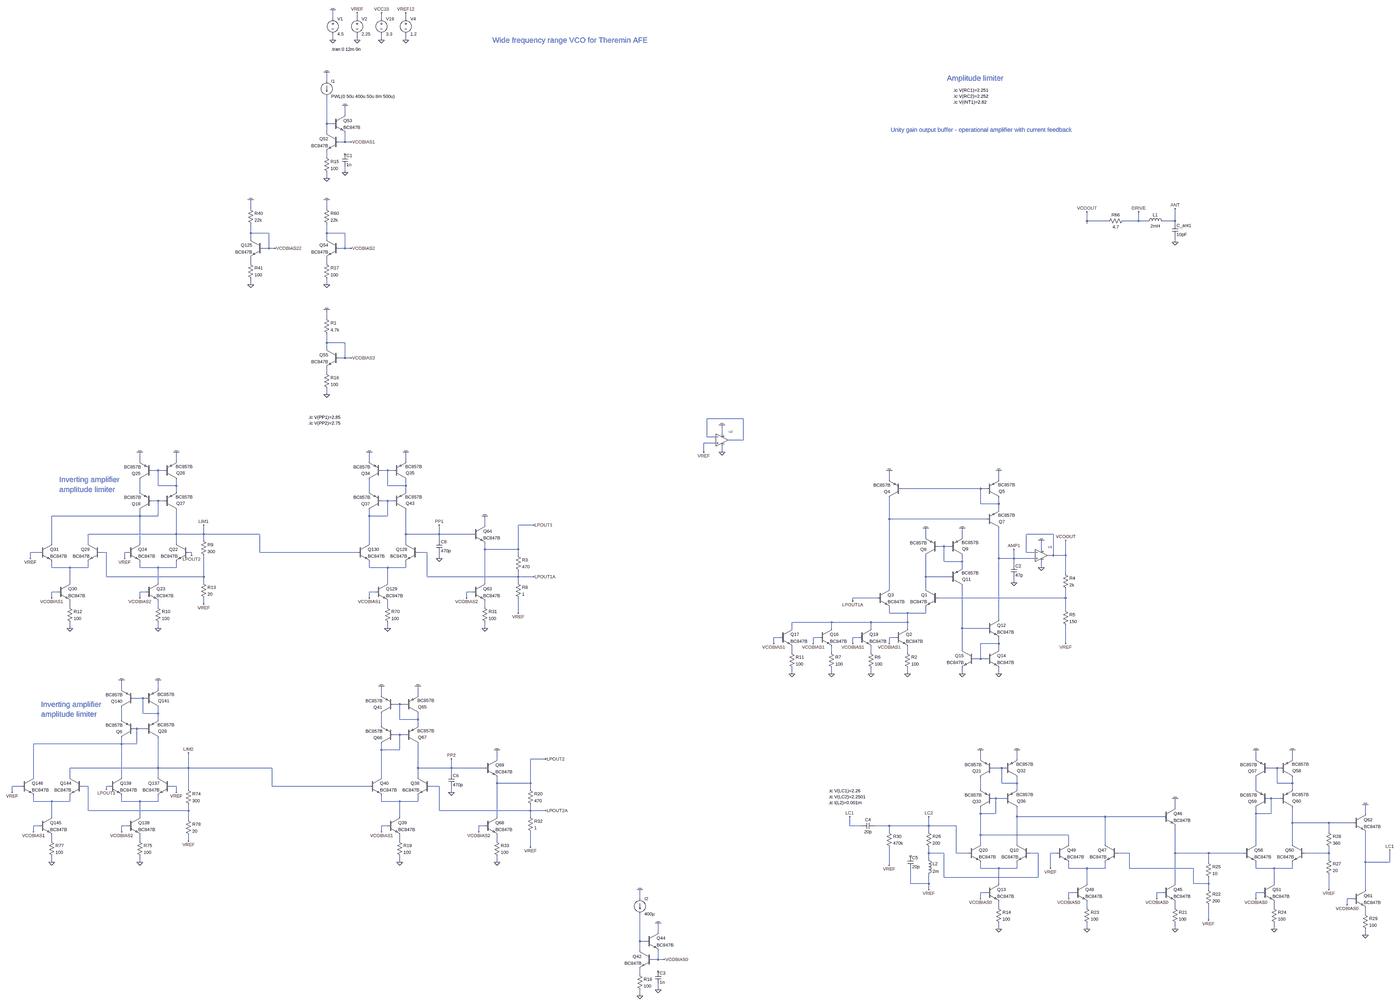
[diagram p0: schematic vco_sine_bjt_v08.asc, whole sheet]
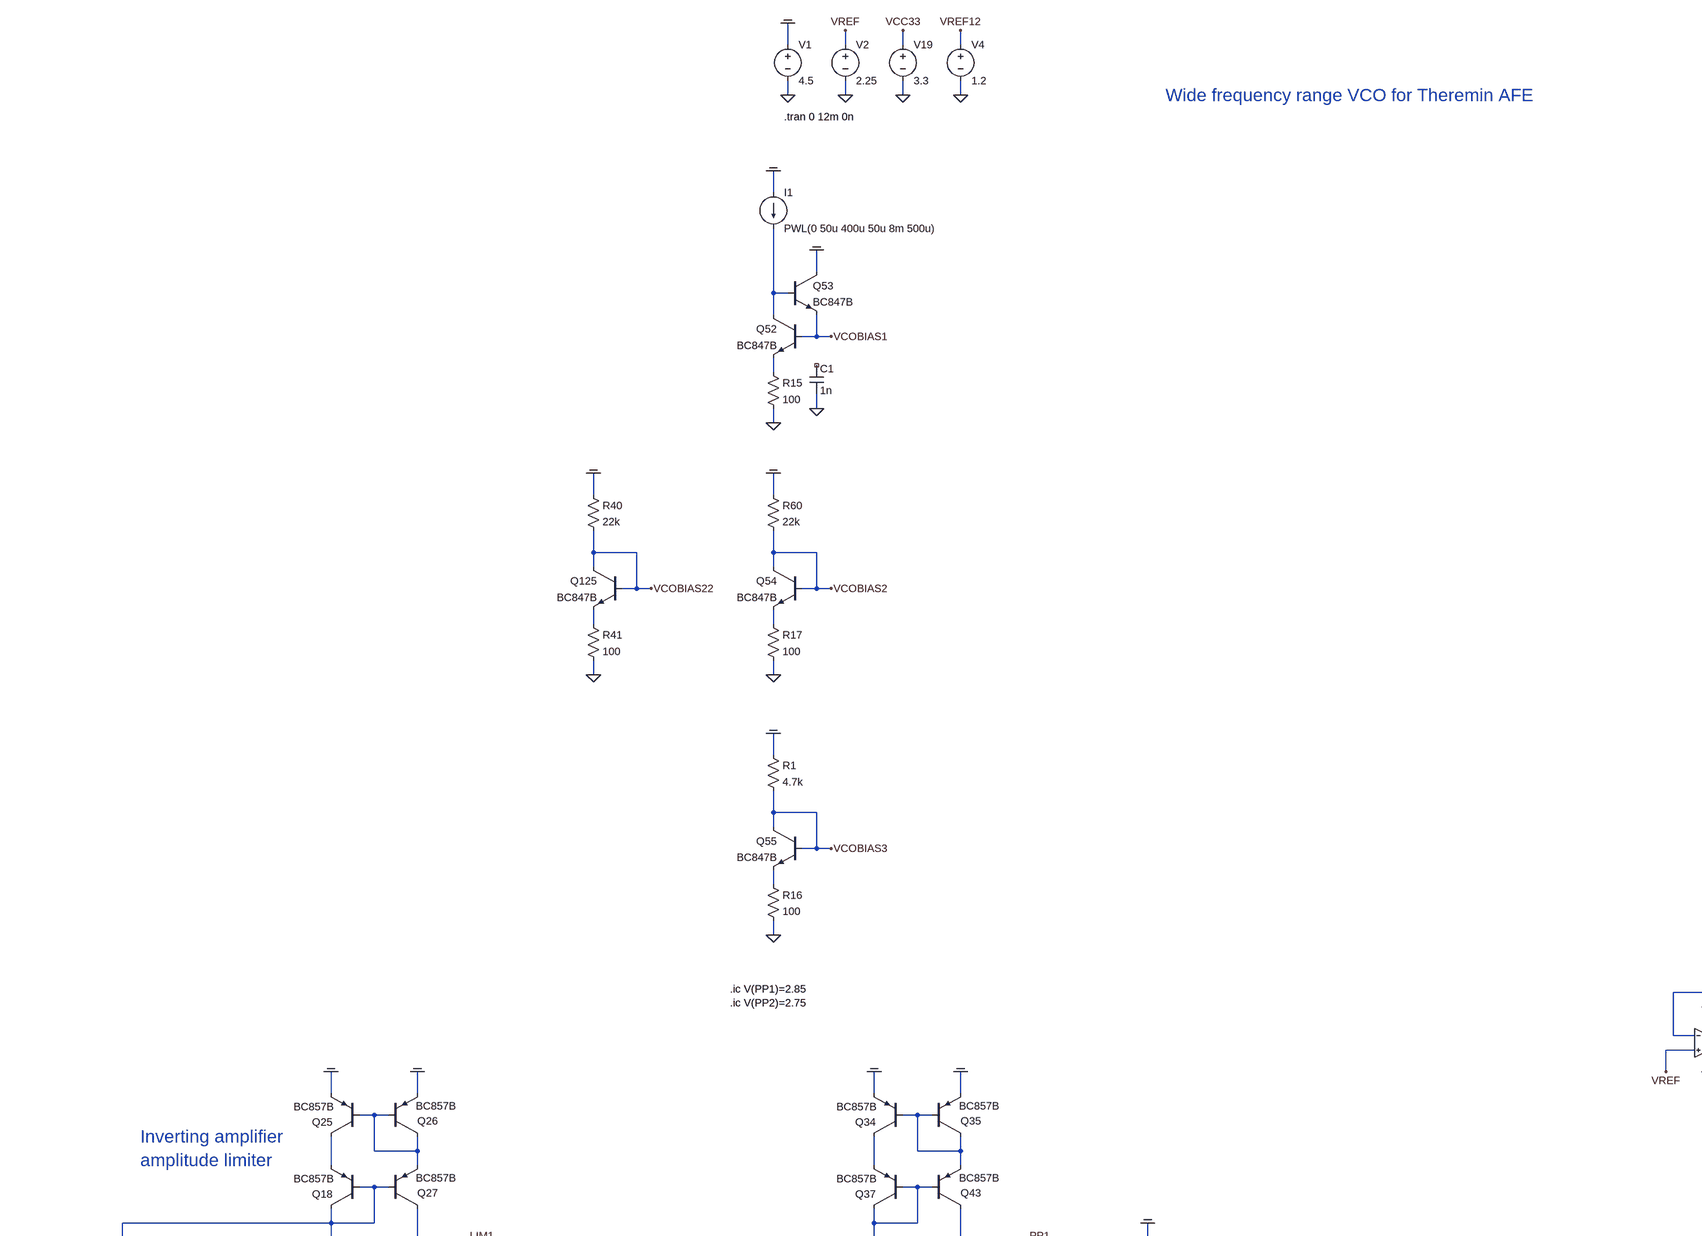
[diagram p1: schematic vco_sine_bjt_v08.asc, part, row 1 of 2, column 1 of 2]
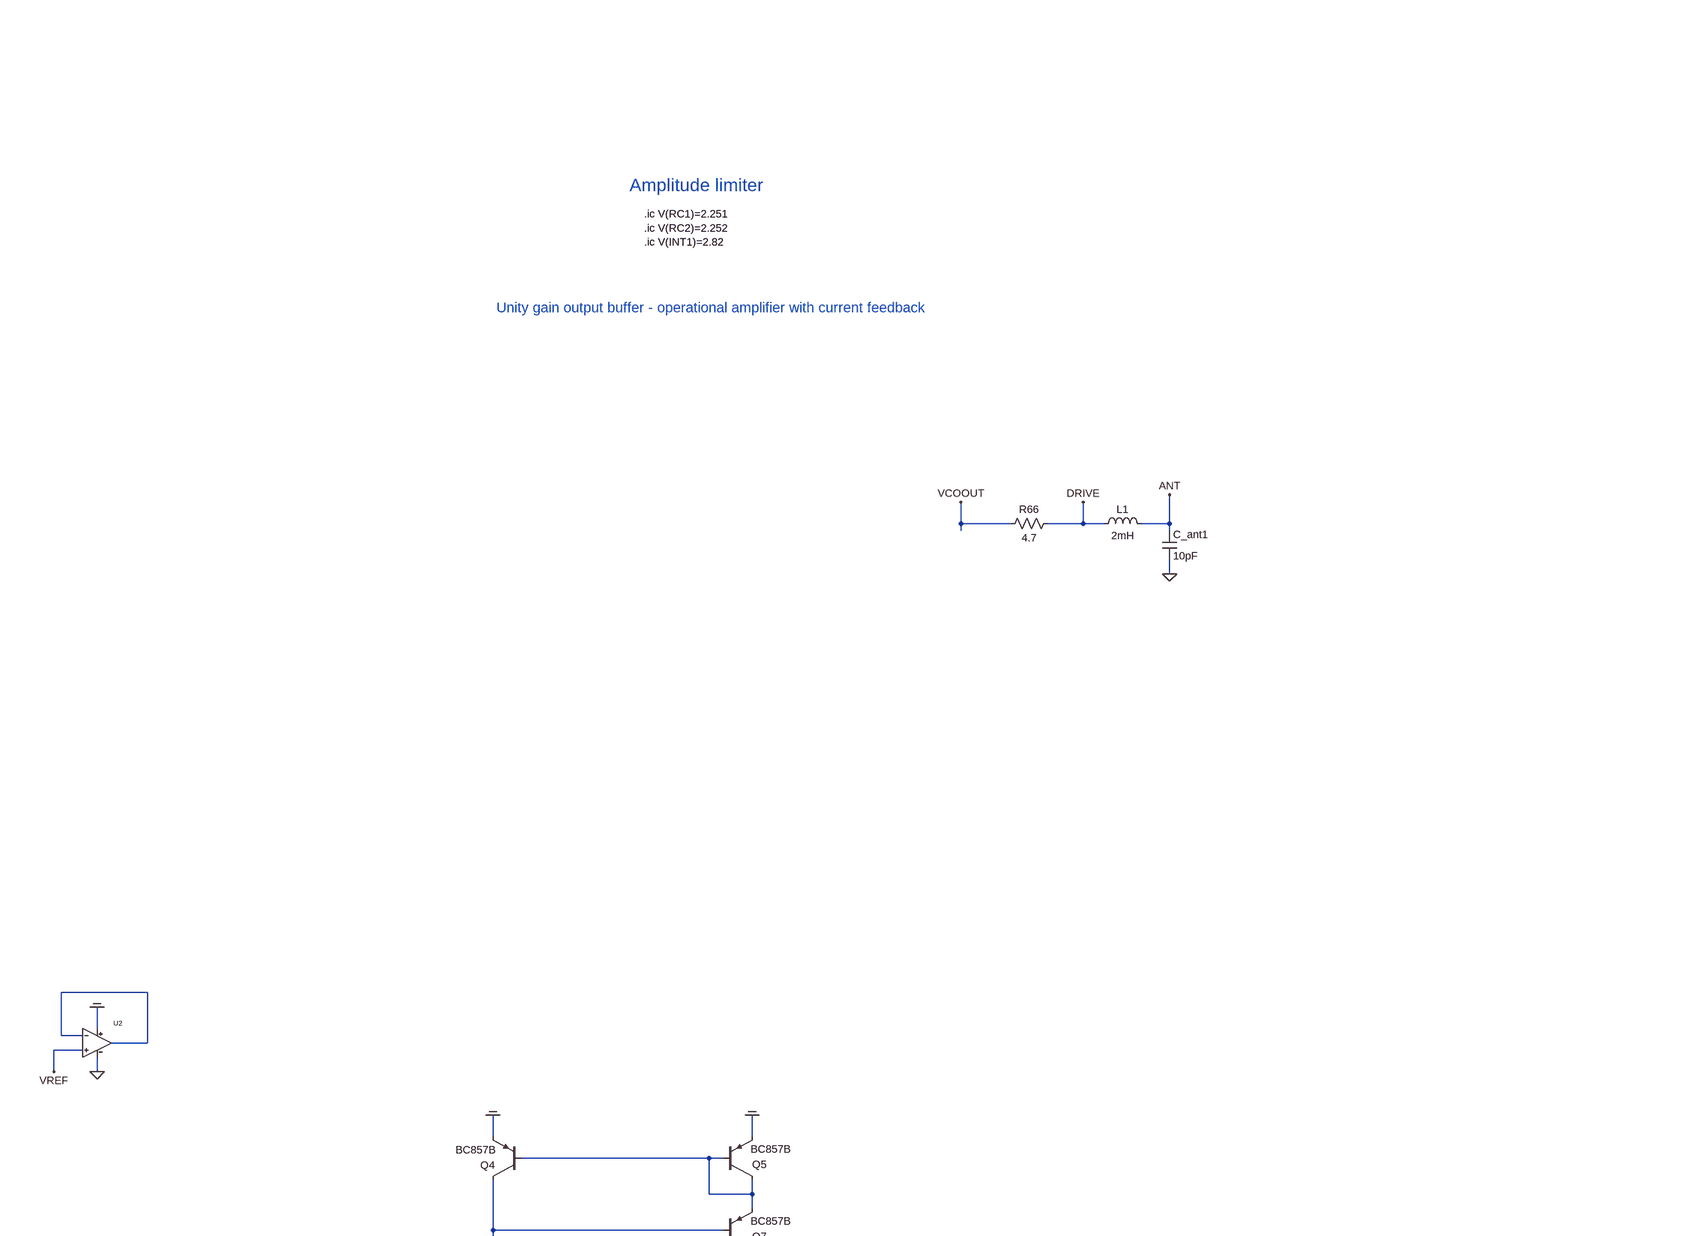
[diagram p2: schematic vco_sine_bjt_v08.asc, part, row 1 of 2, column 2 of 2]
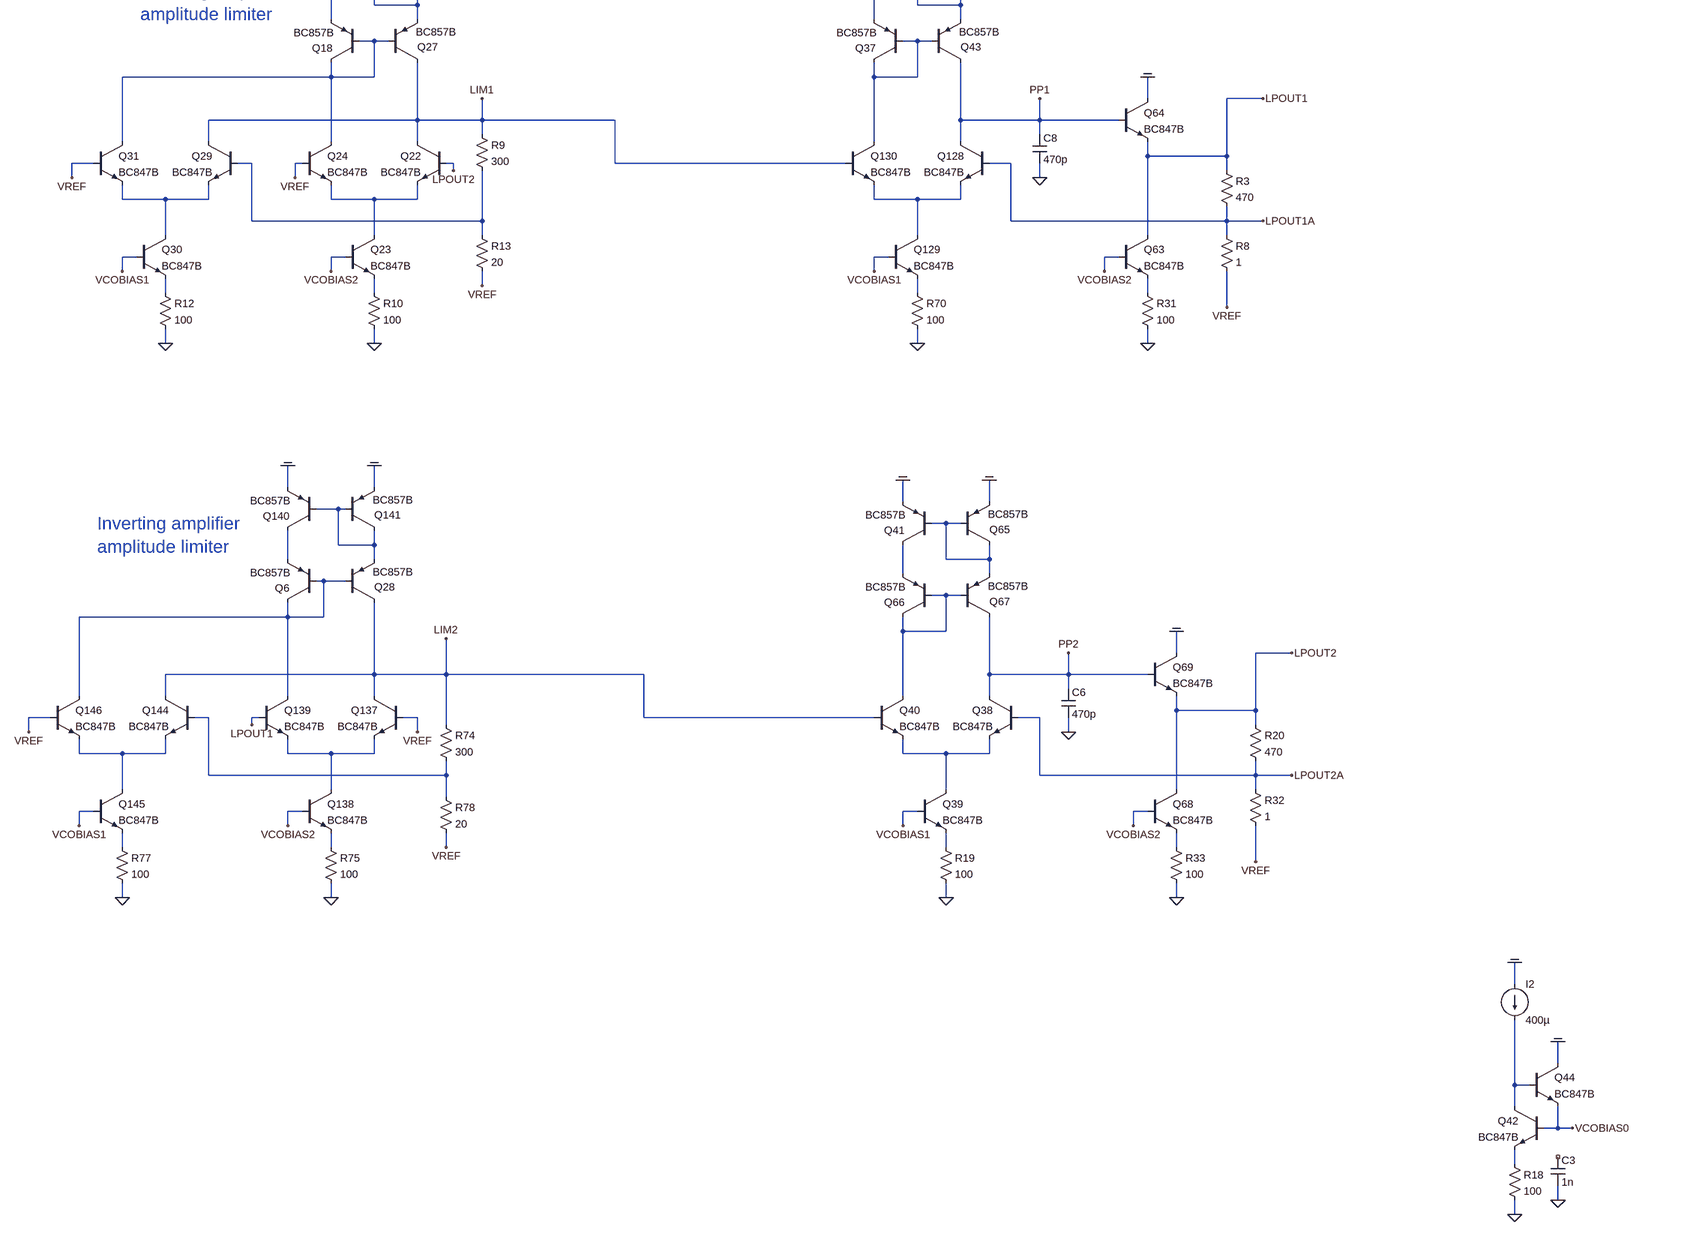
[diagram p3: schematic vco_sine_bjt_v08.asc, part, row 2 of 2, column 1 of 2]
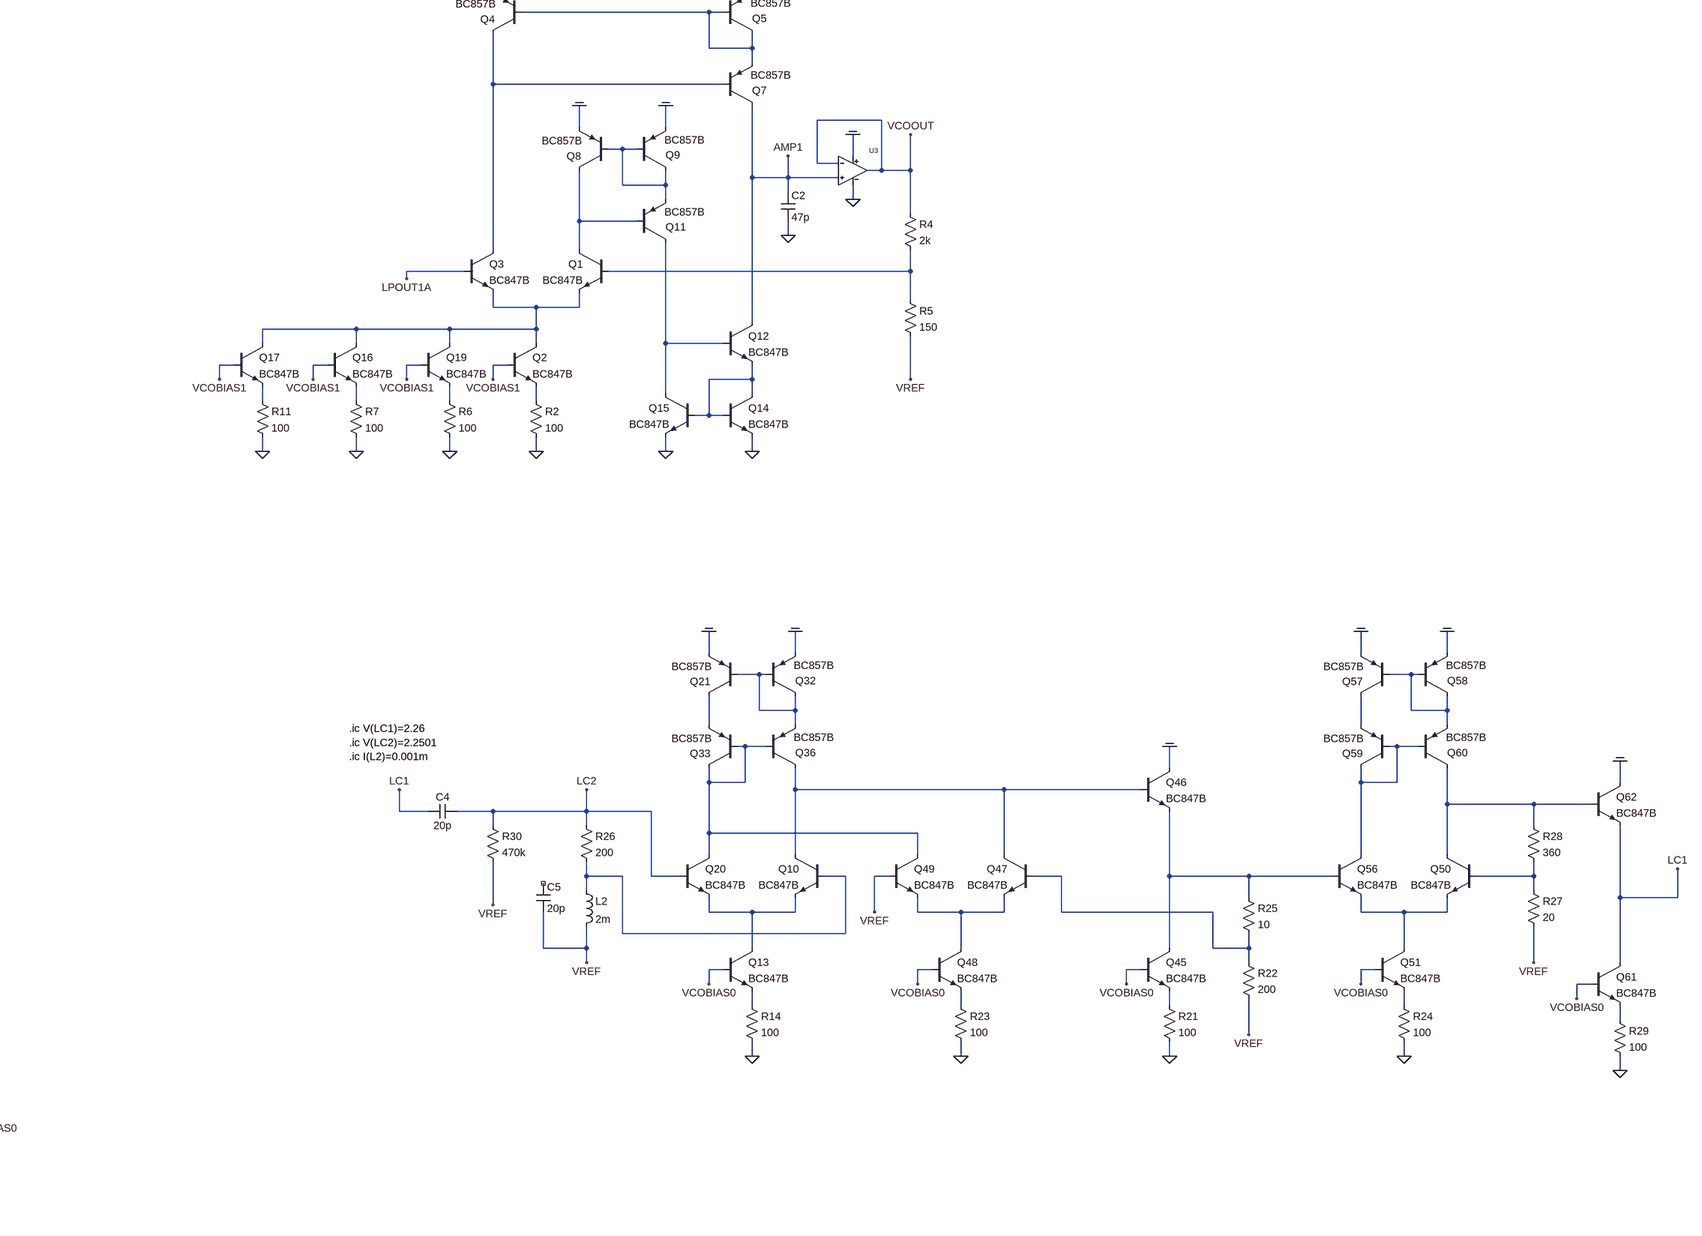
[diagram p4: schematic vco_sine_bjt_v08.asc, part, row 2 of 2, column 2 of 2]
vco_sine_bjt_v08.asc, the LTspice schematic file:
Version 4
SHEET 1 13504 19328
WIRE -432 13600 -432 13552
WIRE -304 13600 -304 13568
WIRE -176 13600 -176 13568
WIRE -48 13600 -48 13568
WIRE -432 13712 -432 13680
WIRE -304 13712 -304 13680
WIRE -176 13712 -176 13680
WIRE -48 13712 -48 13680
WIRE -464 14000 -464 13952
WIRE -368 14176 -368 14128
WIRE -464 14224 -464 14080
WIRE -432 14224 -464 14224
WIRE -464 14272 -464 14224
WIRE -368 14320 -368 14272
WIRE -368 14320 -400 14320
WIRE -336 14320 -368 14320
WIRE -464 14400 -464 14368
WIRE -368 14480 -368 14448
WIRE -464 14512 -464 14480
WIRE -864 14672 -864 14624
WIRE -464 14672 -464 14624
WIRE 3536 14736 3536 14688
WIRE 3648 14736 3536 14736
WIRE 3808 14736 3808 14688
WIRE 3808 14736 3728 14736
WIRE 3856 14736 3808 14736
WIRE 4000 14736 4000 14672
WIRE 4000 14736 3936 14736
WIRE 3536 14752 3536 14736
WIRE 4000 14752 4000 14736
WIRE -864 14800 -864 14752
WIRE -768 14800 -864 14800
WIRE -464 14800 -464 14752
WIRE -368 14800 -464 14800
WIRE -864 14832 -864 14800
WIRE -464 14832 -464 14800
WIRE 4000 14848 4000 14816
WIRE -768 14880 -768 14800
WIRE -768 14880 -800 14880
WIRE -736 14880 -768 14880
WIRE -368 14880 -368 14800
WIRE -368 14880 -400 14880
WIRE -336 14880 -368 14880
WIRE -864 14960 -864 14928
WIRE -464 14960 -464 14928
WIRE -864 15072 -864 15040
WIRE -464 15072 -464 15040
WIRE -464 15280 -464 15232
WIRE -464 15408 -464 15360
WIRE -368 15408 -464 15408
WIRE -464 15440 -464 15408
WIRE -368 15488 -368 15408
WIRE -368 15488 -400 15488
WIRE -336 15488 -368 15488
WIRE -464 15568 -464 15536
WIRE -464 15680 -464 15648
WIRE 1728 15808 1536 15808
WIRE 1616 15888 1616 15840
WIRE 1536 15904 1536 15808
WIRE 1584 15904 1536 15904
WIRE 1728 15920 1728 15808
WIRE 1728 15920 1648 15920
WIRE 1584 15936 1520 15936
WIRE 1520 15984 1520 15936
WIRE 1616 15984 1616 15952
WIRE -1504 16032 -1504 15984
WIRE -1312 16032 -1312 15984
WIRE -240 16032 -240 15984
WIRE -48 16032 -48 15984
WIRE -1408 16080 -1440 16080
WIRE -1376 16080 -1408 16080
WIRE -144 16080 -176 16080
WIRE -112 16080 -144 16080
WIRE 2496 16128 2496 16080
WIRE 3072 16128 3072 16080
WIRE -1408 16160 -1408 16080
WIRE -1312 16160 -1312 16128
WIRE -1312 16160 -1408 16160
WIRE -144 16160 -144 16080
WIRE -48 16160 -48 16128
WIRE -48 16160 -144 16160
WIRE 2976 16176 2560 16176
WIRE 3008 16176 2976 16176
WIRE -1504 16192 -1504 16128
WIRE -1312 16192 -1312 16160
WIRE -240 16192 -240 16128
WIRE -48 16192 -48 16160
WIRE -1408 16240 -1440 16240
WIRE -1376 16240 -1408 16240
WIRE -144 16240 -176 16240
WIRE -112 16240 -144 16240
WIRE 2976 16256 2976 16176
WIRE 3072 16256 3072 16224
WIRE 3072 16256 2976 16256
WIRE 3072 16288 3072 16256
WIRE -1504 16320 -1504 16288
WIRE -1504 16320 -1968 16320
WIRE -1408 16320 -1408 16240
WIRE -1408 16320 -1504 16320
WIRE -240 16320 -240 16288
WIRE -144 16320 -144 16240
WIRE -144 16320 -240 16320
WIRE 2496 16336 2496 16224
WIRE 3008 16336 2496 16336
WIRE 368 16368 368 16320
WIRE 624 16368 544 16368
WIRE -1312 16416 -1312 16288
WIRE -1312 16416 -1776 16416
WIRE -1168 16416 -1168 16368
WIRE -1168 16416 -1312 16416
WIRE -816 16416 -1168 16416
WIRE -48 16416 -48 16288
WIRE 128 16416 128 16368
WIRE 128 16416 -48 16416
WIRE 304 16416 128 16416
WIRE 3360 16416 3216 16416
WIRE 2688 16432 2688 16384
WIRE 2880 16432 2880 16384
WIRE -1168 16448 -1168 16416
WIRE 128 16448 128 16416
WIRE -1968 16464 -1968 16320
WIRE -1776 16464 -1776 16416
WIRE -1504 16464 -1504 16320
WIRE -1312 16464 -1312 16416
WIRE -240 16464 -240 16320
WIRE -48 16464 -48 16416
WIRE 2784 16480 2752 16480
WIRE 2816 16480 2784 16480
WIRE 368 16496 368 16464
WIRE 544 16496 544 16368
WIRE 544 16496 368 16496
WIRE 3296 16496 3296 16448
WIRE -2032 16512 -2080 16512
WIRE -1680 16512 -1712 16512
WIRE -1568 16512 -1584 16512
WIRE -1232 16512 -1248 16512
WIRE -816 16512 -816 16416
WIRE -304 16512 -816 16512
WIRE 64 16512 16 16512
WIRE 3216 16512 3216 16416
WIRE 3264 16512 3216 16512
WIRE -1232 16528 -1232 16512
WIRE 544 16528 544 16496
WIRE 3360 16528 3360 16416
WIRE 3360 16528 3328 16528
WIRE 3424 16528 3424 16448
WIRE 3424 16528 3360 16528
WIRE -2080 16544 -2080 16512
WIRE -1584 16544 -1584 16512
WIRE 128 16544 128 16512
WIRE 3072 16544 3072 16384
WIRE 3152 16544 3152 16496
WIRE 3152 16544 3072 16544
WIRE 3264 16544 3152 16544
WIRE 2784 16560 2784 16480
WIRE 2880 16560 2880 16528
WIRE 2880 16560 2784 16560
WIRE 3152 16576 3152 16544
WIRE -1968 16592 -1968 16560
WIRE -1872 16592 -1968 16592
WIRE -1776 16592 -1776 16560
WIRE -1776 16592 -1872 16592
WIRE -1504 16592 -1504 16560
WIRE -1408 16592 -1504 16592
WIRE -1312 16592 -1312 16560
WIRE -1312 16592 -1408 16592
WIRE -240 16592 -240 16560
WIRE -144 16592 -240 16592
WIRE -48 16592 -48 16560
WIRE -48 16592 -144 16592
WIRE 2880 16592 2880 16560
WIRE 3296 16592 3296 16560
WIRE 3424 16624 3424 16528
WIRE -1680 16640 -1680 16512
WIRE -1168 16640 -1168 16528
WIRE -1168 16640 -1680 16640
WIRE 64 16640 64 16512
WIRE 544 16640 544 16608
WIRE 544 16640 64 16640
WIRE 624 16640 544 16640
WIRE 2688 16640 2688 16528
WIRE 2816 16640 2688 16640
WIRE -1872 16672 -1872 16592
WIRE -1408 16672 -1408 16592
WIRE -1168 16672 -1168 16640
WIRE -144 16672 -144 16592
WIRE 368 16672 368 16496
WIRE 544 16672 544 16640
WIRE 3152 16672 3152 16640
WIRE 2496 16704 2496 16336
WIRE 2688 16704 2688 16640
WIRE -1936 16720 -1968 16720
WIRE -1472 16720 -1504 16720
WIRE -208 16720 -240 16720
WIRE 304 16720 272 16720
WIRE -1968 16752 -1968 16720
WIRE -1504 16752 -1504 16720
WIRE -240 16752 -240 16720
WIRE 272 16752 272 16720
WIRE 2432 16752 2304 16752
WIRE 3424 16752 3424 16704
WIRE 3424 16752 2752 16752
WIRE 2304 16768 2304 16752
WIRE -1168 16784 -1168 16752
WIRE -1872 16800 -1872 16768
WIRE -1408 16800 -1408 16768
WIRE -144 16800 -144 16768
WIRE 368 16800 368 16768
WIRE 3424 16816 3424 16752
WIRE 544 16832 544 16752
WIRE 2496 16832 2496 16800
WIRE 2592 16832 2496 16832
WIRE 2688 16832 2688 16800
WIRE 2688 16832 2592 16832
WIRE 3072 16864 3072 16544
WIRE 2192 16880 1984 16880
WIRE 2400 16880 2192 16880
WIRE 2592 16880 2592 16832
WIRE 2592 16880 2400 16880
WIRE -1872 16912 -1872 16880
WIRE -1408 16912 -1408 16880
WIRE -144 16912 -144 16880
WIRE 368 16912 368 16880
WIRE 1984 16912 1984 16880
WIRE 2192 16912 2192 16880
WIRE 2400 16912 2400 16880
WIRE 2592 16912 2592 16880
WIRE 2880 16912 2880 16688
WIRE 3008 16912 2880 16912
WIRE 1920 16960 1888 16960
WIRE 2128 16960 2096 16960
WIRE 2336 16960 2304 16960
WIRE 2528 16960 2496 16960
WIRE 1888 16992 1888 16960
WIRE 2096 16992 2096 16960
WIRE 2304 16992 2304 16960
WIRE 2496 16992 2496 16960
WIRE 3072 16992 3072 16960
WIRE 3072 16992 2976 16992
WIRE 3424 16992 3424 16896
WIRE 2880 17024 2880 16912
WIRE 3072 17024 3072 16992
WIRE 1984 17040 1984 17008
WIRE 2192 17040 2192 17008
WIRE 2400 17040 2400 17008
WIRE 2592 17040 2592 17008
WIRE 2976 17072 2976 16992
WIRE 2976 17072 2944 17072
WIRE 3008 17072 2976 17072
WIRE 1984 17152 1984 17120
WIRE 2192 17152 2192 17120
WIRE 2400 17152 2400 17120
WIRE 2592 17152 2592 17120
WIRE 2880 17152 2880 17120
WIRE 3072 17152 3072 17120
WIRE -1600 17232 -1600 17184
WIRE -1408 17232 -1408 17184
WIRE -176 17264 -176 17216
WIRE 16 17264 16 17216
WIRE -1488 17280 -1536 17280
WIRE -1472 17280 -1488 17280
WIRE -80 17312 -112 17312
WIRE -48 17312 -80 17312
WIRE -1488 17360 -1488 17280
WIRE -1408 17360 -1408 17328
WIRE -1408 17360 -1488 17360
WIRE -1600 17392 -1600 17328
WIRE -1408 17392 -1408 17360
WIRE -80 17392 -80 17312
WIRE 16 17392 16 17360
WIRE 16 17392 -80 17392
WIRE -176 17424 -176 17360
WIRE 16 17424 16 17392
WIRE -1520 17440 -1536 17440
WIRE -1472 17440 -1520 17440
WIRE -80 17472 -112 17472
WIRE -48 17472 -80 17472
WIRE -1600 17520 -1600 17488
WIRE -1600 17520 -2064 17520
WIRE -1520 17520 -1520 17440
WIRE -1520 17520 -1600 17520
WIRE -176 17552 -176 17520
WIRE -80 17552 -80 17472
WIRE -80 17552 -176 17552
WIRE 432 17600 432 17552
WIRE 688 17600 608 17600
WIRE 2976 17600 2976 17552
WIRE 3168 17600 3168 17552
WIRE 4432 17600 4432 17552
WIRE 4624 17600 4624 17552
WIRE -1408 17648 -1408 17488
WIRE -1408 17648 -1872 17648
WIRE -1248 17648 -1248 17568
WIRE -1248 17648 -1408 17648
WIRE -752 17648 -1248 17648
WIRE 16 17648 16 17520
WIRE 192 17648 192 17600
WIRE 192 17648 16 17648
WIRE 368 17648 192 17648
WIRE 3088 17648 3040 17648
WIRE 3104 17648 3088 17648
WIRE 4544 17648 4496 17648
WIRE 4560 17648 4544 17648
WIRE 192 17680 192 17648
WIRE -2064 17696 -2064 17520
WIRE -1872 17696 -1872 17648
WIRE -1600 17696 -1600 17520
WIRE -1408 17696 -1408 17648
WIRE -176 17696 -176 17552
WIRE 16 17696 16 17648
WIRE 432 17728 432 17696
WIRE 608 17728 608 17600
WIRE 608 17728 432 17728
WIRE 3088 17728 3088 17648
WIRE 3168 17728 3168 17696
WIRE 3168 17728 3088 17728
WIRE 4544 17728 4544 17648
WIRE 4624 17728 4624 17696
WIRE 4624 17728 4544 17728
WIRE -2128 17744 -2176 17744
WIRE -1776 17744 -1808 17744
WIRE -1664 17744 -1680 17744
WIRE -1312 17744 -1344 17744
WIRE -752 17744 -752 17648
WIRE -240 17744 -752 17744
WIRE 128 17744 80 17744
WIRE -1680 17760 -1680 17744
WIRE -1248 17760 -1248 17648
WIRE 608 17760 608 17728
WIRE 2976 17760 2976 17696
WIRE 3168 17760 3168 17728
WIRE 4432 17760 4432 17696
WIRE 4624 17760 4624 17728
WIRE -2176 17776 -2176 17744
WIRE -1312 17776 -1312 17744
WIRE 192 17776 192 17744
WIRE 3056 17808 3040 17808
WIRE 3104 17808 3056 17808
WIRE 4512 17808 4496 17808
WIRE 4560 17808 4512 17808
WIRE -2064 17824 -2064 17792
WIRE -1968 17824 -2064 17824
WIRE -1872 17824 -1872 17792
WIRE -1872 17824 -1968 17824
WIRE -1600 17824 -1600 17792
WIRE -1504 17824 -1600 17824
WIRE -1408 17824 -1408 17792
WIRE -1408 17824 -1504 17824
WIRE -176 17824 -176 17792
WIRE -80 17824 -176 17824
WIRE 16 17824 16 17792
WIRE 16 17824 -80 17824
WIRE 4000 17856 4000 17808
WIRE -1776 17872 -1776 17744
WIRE -1248 17872 -1248 17840
WIRE -1248 17872 -1776 17872
WIRE 128 17872 128 17744
WIRE 608 17872 608 17840
WIRE 608 17872 128 17872
WIRE 688 17872 608 17872
WIRE 2976 17888 2976 17856
WIRE 3056 17888 3056 17808
WIRE 3056 17888 2976 17888
WIRE 4432 17888 4432 17856
WIRE 4512 17888 4512 17808
WIRE 4512 17888 4432 17888
WIRE 5008 17888 5008 17840
WIRE -1968 17904 -1968 17824
WIRE -1504 17904 -1504 17824
WIRE -80 17904 -80 17824
WIRE 432 17904 432 17728
WIRE 608 17904 608 17872
WIRE 3168 17904 3168 17856
WIRE 3632 17904 3168 17904
WIRE 3936 17904 3632 17904
WIRE -1248 17920 -1248 17872
WIRE 4624 17936 4624 17856
WIRE 4816 17936 4624 17936
WIRE 4944 17936 4816 17936
WIRE -2032 17952 -2064 17952
WIRE -1568 17952 -1600 17952
WIRE -144 17952 -176 17952
WIRE 368 17952 336 17952
WIRE 2288 17952 2288 17904
WIRE 2352 17952 2288 17952
WIRE 2496 17952 2416 17952
WIRE 2704 17952 2704 17904
WIRE 2704 17952 2496 17952
WIRE 2848 17952 2704 17952
WIRE -2064 17984 -2064 17952
WIRE -1600 17984 -1600 17952
WIRE -176 17984 -176 17952
WIRE 336 17984 336 17952
WIRE 2496 17984 2496 17952
WIRE 2704 17984 2704 17952
WIRE 4816 17984 4816 17936
WIRE 2976 18000 2976 17888
WIRE 3440 18000 2976 18000
WIRE -1968 18032 -1968 18000
WIRE -1504 18032 -1504 18000
WIRE -1248 18032 -1248 18000
WIRE -80 18032 -80 18000
WIRE 432 18032 432 18000
WIRE 2976 18048 2976 18000
WIRE 3168 18048 3168 17904
WIRE 3440 18048 3440 18000
WIRE 3632 18048 3632 17904
WIRE 4432 18048 4432 17888
WIRE 4624 18048 4624 17936
WIRE 608 18064 608 17984
WIRE 2704 18096 2704 18064
WIRE 2784 18096 2704 18096
WIRE 2848 18096 2848 17952
WIRE 2912 18096 2848 18096
WIRE 3280 18096 3232 18096
WIRE 3376 18096 3344 18096
WIRE 3760 18096 3696 18096
WIRE 4000 18096 4000 17952
WIRE 4176 18096 4000 18096
WIRE 4368 18096 4176 18096
WIRE 4816 18096 4816 18064
WIRE 4816 18096 4688 18096
WIRE 2704 18128 2704 18096
WIRE 4816 18128 4816 18096
WIRE -1968 18144 -1968 18112
WIRE -1504 18144 -1504 18112
WIRE -80 18144 -80 18112
WIRE 432 18144 432 18112
WIRE 4176 18144 4176 18096
WIRE 5008 18144 5008 17984
WIRE 5136 18144 5136 18080
WIRE 5136 18144 5008 18144
WIRE 2496 18160 2496 18064
WIRE 2976 18176 2976 18144
WIRE 3072 18176 2976 18176
WIRE 3168 18176 3168 18144
WIRE 3168 18176 3072 18176
WIRE 3344 18176 3344 18096
WIRE 3440 18176 3440 18144
WIRE 3536 18176 3440 18176
WIRE 3632 18176 3632 18144
WIRE 3632 18176 3536 18176
WIRE 3760 18176 3760 18096
WIRE 4096 18176 3760 18176
WIRE 4432 18176 4432 18144
WIRE 4528 18176 4432 18176
WIRE 4624 18176 4624 18144
WIRE 4624 18176 4528 18176
WIRE 2784 18224 2784 18096
WIRE 3280 18224 3280 18096
WIRE 3280 18224 2784 18224
WIRE 2608 18256 2608 18176
WIRE 2704 18256 2704 18208
WIRE 2704 18256 2608 18256
WIRE 3072 18256 3072 18176
WIRE 3536 18256 3536 18176
WIRE 4000 18256 4000 18096
WIRE 4096 18256 4096 18176
WIRE 4176 18256 4176 18224
WIRE 4176 18256 4096 18256
WIRE 4528 18256 4528 18176
WIRE 2704 18288 2704 18256
WIRE 4176 18288 4176 18256
WIRE 4816 18288 4816 18208
WIRE 5008 18288 5008 18144
WIRE 3008 18304 2976 18304
WIRE 3472 18304 3440 18304
WIRE 3936 18304 3904 18304
WIRE 4464 18304 4432 18304
WIRE 1184 18336 1184 18288
WIRE 2976 18336 2976 18304
WIRE 3440 18336 3440 18304
WIRE 3904 18336 3904 18304
WIRE 4432 18336 4432 18304
WIRE 4944 18336 4912 18336
WIRE 4912 18368 4912 18336
WIRE 3072 18384 3072 18352
WIRE 3536 18384 3536 18352
WIRE 4000 18384 4000 18352
WIRE 4528 18384 4528 18352
WIRE 5008 18416 5008 18384
WIRE 4176 18448 4176 18368
WIRE 3072 18496 3072 18464
WIRE 3536 18496 3536 18464
WIRE 4000 18496 4000 18464
WIRE 4528 18496 4528 18464
WIRE 1280 18512 1280 18464
WIRE 5008 18528 5008 18496
WIRE 1184 18560 1184 18416
WIRE 1216 18560 1184 18560
WIRE 1184 18608 1184 18560
WIRE 1280 18656 1280 18608
WIRE 1280 18656 1248 18656
WIRE 1312 18656 1280 18656
WIRE 1184 18736 1184 18704
WIRE 1280 18816 1280 18784
WIRE 1184 18848 1184 18816
FLAG -432 13712 0
FLAG -432 13552 COM
FLAG -304 13712 0
FLAG -304 13568 VREF
FLAG -176 13712 0
FLAG -176 13568 VCC33
FLAG -48 13712 0
FLAG -48 13568 VREF12
FLAG -336 14320 VCOBIAS1
FLAG -464 14624 COM
FLAG -464 15232 COM
FLAG -464 13952 COM
FLAG -336 14880 VCOBIAS2
FLAG -336 15488 VCOBIAS3
FLAG -368 14128 COM
FLAG -464 14512 0
FLAG -464 15680 0
FLAG -464 15072 0
FLAG -368 14480 0
FLAG -864 14624 COM
FLAG -736 14880 VCOBIAS22
FLAG -864 15072 0
FLAG 4000 14848 0
FLAG 4000 14672 ANT
FLAG 3808 14688 DRIVE
FLAG 3536 14688 VCOOUT
FLAG -240 16752 VCOBIAS1
FLAG -144 16912 0
FLAG 128 16544 0
FLAG -1600 17984 VCOBIAS2
FLAG -1248 18032 VREF
FLAG -1248 17568 LIM2
FLAG -1504 18144 0
FLAG -1600 17184 COM
FLAG -1408 17184 COM
FLAG -2064 17984 VCOBIAS1
FLAG -1968 18144 0
FLAG 128 16368 PP1
FLAG 2496 16992 VCOBIAS1
FLAG 2592 17152 0
FLAG 2496 16080 COM
FLAG 3072 16080 COM
FLAG 2688 16384 COM
FLAG 2880 16384 COM
FLAG 2880 17152 0
FLAG 3072 17152 0
FLAG 3152 16672 0
FLAG 3152 16496 AMP1
FLAG 2304 16768 LPOUT1A
FLAG 3424 16992 VREF
FLAG 2304 16992 VCOBIAS1
FLAG 2400 17152 0
FLAG 3424 16448 VCOOUT
FLAG -1504 16752 VCOBIAS2
FLAG -1168 16784 VREF
FLAG -1168 16368 LIM1
FLAG -1408 16912 0
FLAG -1584 16544 VREF
FLAG -1504 15984 COM
FLAG -1312 15984 COM
FLAG -1968 16752 VCOBIAS1
FLAG -1872 16912 0
FLAG -1232 16528 LPOUT2
FLAG -1680 17760 LPOUT1
FLAG -2080 16544 VREF
FLAG -2176 17776 VREF
FLAG -1312 17776 VREF
FLAG 624 16368 LPOUT1
FLAG 1616 15984 0
FLAG 1616 15840 COM
FLAG 3296 16592 0
FLAG 3296 16448 COM
FLAG 544 16832 VREF
FLAG 624 16640 LPOUT1A
FLAG 2096 16992 VCOBIAS1
FLAG 2192 17152 0
FLAG 1888 16992 VCOBIAS1
FLAG 1984 17152 0
FLAG -240 15984 COM
FLAG -48 15984 COM
FLAG 2976 18336 VCOBIAS0
FLAG 3072 18496 0
FLAG 2976 17552 COM
FLAG 3168 17552 COM
FLAG 1312 18656 VCOBIAS0
FLAG 1184 18288 COM
FLAG 1280 18464 COM
FLAG 1184 18848 0
FLAG 1280 18816 0
FLAG 2704 18288 VREF
FLAG 2288 17904 LC1
FLAG 2704 17904 LC2
FLAG 3904 18336 VCOBIAS0
FLAG 4000 18496 0
FLAG 4000 17808 COM
FLAG 3440 18336 VCOBIAS0
FLAG 3536 18496 0
FLAG 3344 18176 VREF
FLAG 4432 18336 VCOBIAS0
FLAG 4528 18496 0
FLAG 4432 17552 COM
FLAG 4624 17552 COM
FLAG 4816 18288 VREF
FLAG 5136 18080 LC1
FLAG 4912 18368 VCOBIAS0
FLAG 5008 18528 0
FLAG 5008 17840 COM
FLAG 4176 18448 VREF
FLAG 2496 18160 VREF
FLAG 1520 15984 VREF
FLAG 272 16752 VCOBIAS2
FLAG 368 16912 0
FLAG 368 16320 COM
FLAG -176 17984 VCOBIAS1
FLAG -80 18144 0
FLAG 192 17776 0
FLAG 192 17600 PP2
FLAG 688 17600 LPOUT2
FLAG 608 18064 VREF
FLAG 688 17872 LPOUT2A
FLAG -176 17216 COM
FLAG 16 17216 COM
FLAG 336 17984 VCOBIAS2
FLAG 432 18144 0
FLAG 432 17552 COM
SYMBOL voltage -432 13584 R0
SYMATTR InstName V1
SYMATTR Value 4.5
SYMBOL Voltage -304 13584 R0
SYMATTR InstName V2
SYMATTR Value 2.25
SYMBOL Voltage -176 13584 R0
SYMATTR InstName V19
SYMATTR Value 3.3
SYMBOL Voltage -48 13584 R0
SYMATTR InstName V4
SYMATTR Value 1.2
SYMBOL npn -400 14272 M0
SYMATTR InstName Q52
SYMATTR Value BC847B
SYMBOL Res -480 14656 R0
SYMATTR InstName R60
SYMATTR Value 22k
SYMBOL Res -480 15264 R0
SYMATTR InstName R1
SYMATTR Value 4.7k
SYMBOL current -464 14000 R0
SYMATTR InstName I1
SYMATTR Value PWL(0 50u 400u 50u 8m 500u)
SYMBOL npn -400 14832 M0
SYMATTR InstName Q54
SYMATTR Value BC847B
SYMBOL npn -400 15440 M0
SYMATTR InstName Q55
SYMATTR Value BC847B
SYMBOL npn -432 14176 R0
SYMATTR InstName Q53
SYMATTR Value BC847B
SYMBOL Res -480 14384 R0
SYMATTR InstName R15
SYMATTR Value 100
SYMBOL Res -480 15552 R0
SYMATTR InstName R16
SYMATTR Value 100
SYMBOL Res -480 14944 R0
SYMATTR InstName R17
SYMATTR Value 100
SYMBOL Cap -384 14384 R0
SYMATTR InstName C1
SYMATTR Value 1n
SYMBOL Res -880 14656 R0
SYMATTR InstName R40
SYMATTR Value 22k
SYMBOL npn -800 14832 M0
SYMATTR InstName Q125
SYMATTR Value BC847B
SYMBOL Res -880 14944 R0
SYMATTR InstName R41
SYMATTR Value 100
SYMBOL ind 3840 14752 R270
WINDOW 0 32 56 VTop 2
WINDOW 3 5 56 VBottom 2
SYMATTR InstName L1
SYMATTR Value 2mH
SYMATTR SpiceLine Rser=120 Cpar=1pF
SYMBOL Cap 3984 14752 R0
SYMATTR InstName C_ant1
SYMATTR Value 10pF
SYMBOL Res 3632 14752 R270
WINDOW 0 32 56 VTop 2
WINDOW 3 0 56 VBottom 2
SYMATTR InstName R66
SYMATTR Value 4.7
SYMBOL npn 16 16464 M0
SYMATTR InstName Q128
SYMATTR Value BC847B
SYMBOL npn -208 16672 R0
SYMATTR InstName Q129
SYMATTR Value BC847B
SYMBOL npn -304 16464 R0
SYMATTR InstName Q130
SYMATTR Value BC847B
SYMBOL Res -160 16784 R0
SYMATTR InstName R70
SYMATTR Value 100
SYMBOL Cap 112 16448 R0
SYMATTR InstName C8
SYMATTR Value 470p
SYMBOL npn -1344 17696 M0
SYMATTR InstName Q137
SYMATTR Value BC847B
SYMBOL npn -1568 17904 R0
SYMATTR InstName Q138
SYMATTR Value BC847B
SYMBOL npn -1664 17696 R0
SYMATTR InstName Q139
SYMATTR Value BC847B
SYMBOL Res -1264 17744 R0
SYMATTR InstName R74
SYMATTR Value 300
SYMBOL Res -1520 18016 R0
SYMATTR InstName R75
SYMATTR Value 100
SYMBOL pnp -1536 17328 R180
WINDOW 0 60 32 Left 2
WINDOW 3 58 66 Left 2
SYMATTR InstName Q140
SYMATTR Value BC857B
SYMBOL pnp -1472 17328 M180
WINDOW 0 64 34 Left 2
WINDOW 3 61 68 Left 2
SYMATTR InstName Q141
SYMATTR Value BC857B
SYMBOL npn -1808 17696 M0
SYMATTR InstName Q144
SYMATTR Value BC847B
SYMBOL npn -2032 17904 R0
SYMATTR InstName Q145
SYMATTR Value BC847B
SYMBOL npn -2128 17696 R0
SYMATTR InstName Q146
SYMATTR Value BC847B
SYMBOL Res -1984 18016 R0
SYMATTR InstName R77
SYMATTR Value 100
SYMBOL Res -1264 17904 R0
SYMATTR InstName R78
SYMATTR Value 20
SYMBOL npn 2752 16704 M0
SYMATTR InstName Q1
SYMATTR Value BC847B
SYMBOL npn 2528 16912 R0
SYMATTR InstName Q2
SYMATTR Value BC847B
SYMBOL npn 2432 16704 R0
SYMATTR InstName Q3
SYMATTR Value BC847B
SYMBOL Res 2576 17024 R0
SYMATTR InstName R2
SYMATTR Value 100
SYMBOL pnp 2560 16224 R180
WINDOW 0 60 32 Left 2
WINDOW 3 58 66 Left 2
SYMATTR InstName Q4
SYMATTR Value BC857B
SYMBOL pnp 3008 16224 M180
WINDOW 0 64 34 Left 2
WINDOW 3 61 68 Left 2
SYMATTR InstName Q5
SYMATTR Value BC857B
SYMBOL pnp 3008 16384 M180
WINDOW 0 64 34 Left 2
WINDOW 3 61 68 Left 2
SYMATTR InstName Q7
SYMATTR Value BC857B
SYMBOL pnp 2752 16528 R180
WINDOW 0 60 32 Left 2
WINDOW 3 58 66 Left 2
SYMATTR InstName Q8
SYMATTR Value BC857B
SYMBOL pnp 2816 16528 M180
WINDOW 0 64 34 Left 2
WINDOW 3 61 68 Left 2
SYMATTR InstName Q9
SYMATTR Value BC857B
SYMBOL pnp 2816 16688 M180
WINDOW 0 64 34 Left 2
WINDOW 3 61 68 Left 2
SYMATTR InstName Q11
SYMATTR Value BC857B
SYMBOL npn 3008 16864 R0
SYMATTR InstName Q12
SYMATTR Value BC847B
SYMBOL npn 3008 17024 R0
SYMATTR InstName Q14
SYMATTR Value BC847B
SYMBOL npn 2944 17024 M0
SYMATTR InstName Q15
SYMATTR Value BC847B
SYMBOL Cap 3136 16576 R0
SYMATTR InstName C2
SYMATTR Value 47p
SYMBOL Res 3408 16608 R0
SYMATTR InstName R4
SYMATTR Value 2k
SYMBOL Res 3408 16800 R0
SYMATTR InstName R5
SYMATTR Value 150
SYMBOL npn 2336 16912 R0
SYMATTR InstName Q19
SYMATTR Value BC847B
SYMBOL Res 2384 17024 R0
SYMATTR InstName R6
SYMATTR Value 100
SYMBOL npn -1248 16464 M0
SYMATTR InstName Q22
SYMATTR Value BC847B
SYMBOL npn -1472 16672 R0
SYMATTR InstName Q23
SYMATTR Value BC847B
SYMBOL npn -1568 16464 R0
SYMATTR InstName Q24
SYMATTR Value BC847B
SYMBOL Res -1184 16432 R0
SYMATTR InstName R9
SYMATTR Value 300
SYMBOL Res -1424 16784 R0
SYMATTR InstName R10
SYMATTR Value 100
SYMBOL pnp -1440 16128 R180
WINDOW 0 60 32 Left 2
WINDOW 3 58 66 Left 2
SYMATTR InstName Q25
SYMATTR Value BC857B
SYMBOL pnp -1376 16128 M180
WINDOW 0 64 34 Left 2
WINDOW 3 61 68 Left 2
SYMATTR InstName Q26
SYMATTR Value BC857B
SYMBOL npn -1712 16464 M0
SYMATTR InstName Q29
SYMATTR Value BC847B
SYMBOL npn -1936 16672 R0
SYMATTR InstName Q30
SYMATTR Value BC847B
SYMBOL npn -2032 16464 R0
SYMATTR InstName Q31
SYMATTR Value BC847B
SYMBOL Res -1888 16784 R0
SYMATTR InstName R12
SYMATTR Value 100
SYMBOL Res -1184 16656 R0
SYMATTR InstName R13
SYMATTR Value 20
SYMBOL MCP6021 1616 15920 R0
SYMATTR InstName U2
SYMBOL MCP6021 3296 16528 R0
SYMATTR InstName U3
SYMBOL Res 528 16512 R0
SYMATTR InstName R3
SYMATTR Value 470
SYMBOL Res 528 16656 R0
SYMATTR InstName R8
SYMATTR Value 1
SYMBOL npn 2128 16912 R0
SYMATTR InstName Q16
SYMATTR Value BC847B
SYMBOL Res 2176 17024 R0
SYMATTR InstName R7
SYMATTR Value 100
SYMBOL npn 1920 16912 R0
SYMATTR InstName Q17
SYMATTR Value BC847B
SYMBOL Res 1968 17024 R0
SYMATTR InstName R11
SYMATTR Value 100
SYMBOL pnp -1440 16288 R180
WINDOW 0 60 32 Left 2
WINDOW 3 58 66 Left 2
SYMATTR InstName Q18
SYMATTR Value BC857B
SYMBOL pnp -1376 16288 M180
WINDOW 0 64 34 Left 2
WINDOW 3 61 68 Left 2
SYMATTR InstName Q27
SYMATTR Value BC857B
SYMBOL pnp -1536 17488 R180
WINDOW 0 60 32 Left 2
WINDOW 3 58 66 Left 2
SYMATTR InstName Q6
SYMATTR Value BC857B
SYMBOL pnp -1472 17488 M180
WINDOW 0 64 34 Left 2
WINDOW 3 61 68 Left 2
SYMATTR InstName Q28
SYMATTR Value BC857B
SYMBOL pnp -176 16128 R180
WINDOW 0 60 32 Left 2
WINDOW 3 58 66 Left 2
SYMATTR InstName Q34
SYMATTR Value BC857B
SYMBOL pnp -112 16128 M180
WINDOW 0 64 34 Left 2
WINDOW 3 61 68 Left 2
SYMATTR InstName Q35
SYMATTR Value BC857B
SYMBOL pnp -176 16288 R180
WINDOW 0 60 32 Left 2
WINDOW 3 58 66 Left 2
SYMATTR InstName Q37
SYMATTR Value BC857B
SYMBOL pnp -112 16288 M180
WINDOW 0 64 34 Left 2
WINDOW 3 61 68 Left 2
SYMATTR InstName Q43
SYMATTR Value BC857B
SYMBOL npn 3232 18048 M0
SYMATTR InstName Q10
SYMATTR Value BC847B
SYMBOL npn 3008 18256 R0
SYMATTR InstName Q13
SYMATTR Value BC847B
SYMBOL npn 2912 18048 R0
SYMATTR InstName Q20
SYMATTR Value BC847B
SYMBOL Res 3056 18368 R0
SYMATTR InstName R14
SYMATTR Value 100
SYMBOL pnp 3040 17696 R180
WINDOW 0 60 32 Left 2
WINDOW 3 58 66 Left 2
SYMATTR InstName Q21
SYMATTR Value BC857B
SYMBOL pnp 3104 17696 M180
WINDOW 0 64 34 Left 2
WINDOW 3 61 68 Left 2
SYMATTR InstName Q32
SYMATTR Value BC857B
SYMBOL pnp 3040 17856 R180
WINDOW 0 60 32 Left 2
WINDOW 3 58 66 Left 2
SYMATTR InstName Q33
SYMATTR Value BC857B
SYMBOL pnp 3104 17856 M180
WINDOW 0 64 34 Left 2
WINDOW 3 61 68 Left 2
SYMATTR InstName Q36
SYMATTR Value BC857B
SYMBOL npn 1248 18608 M0
SYMATTR InstName Q42
SYMATTR Value BC847B
SYMBOL current 1184 18336 R0
SYMATTR InstName I2
SYMATTR Value 400µ
SYMBOL npn 1216 18512 R0
SYMATTR InstName Q44
SYMATTR Value BC847B
SYMBOL Res 1168 18720 R0
SYMATTR InstName R18
SYMATTR Value 100
SYMBOL Cap 1264 18720 R0
SYMATTR InstName C3
SYMATTR Value 1n
SYMBOL ind 2688 18112 R0
SYMATTR InstName L2
SYMATTR Value 2m
SYMATTR SpiceLine Rser=10 Cpar=1p
SYMBOL Cap 2416 17936 R90
WINDOW 0 0 32 VBottom 2
WINDOW 3 32 32 VTop 2
SYMATTR InstName C4
SYMATTR Value 20p
SYMBOL Res 2688 17968 R0
SYMATTR InstName R26
SYMATTR Value 200
SYMBOL npn 3936 18256 R0
SYMATTR InstName Q45
SYMATTR Value BC847B
SYMBOL Res 3984 18368 R0
SYMATTR InstName R21
SYMATTR Value 100
SYMBOL npn 3936 17856 R0
SYMATTR InstName Q46
SYMATTR Value BC847B
SYMBOL npn 3696 18048 M0
SYMATTR InstName Q47
SYMATTR Value BC847B
SYMBOL npn 3472 18256 R0
SYMATTR InstName Q48
SYMATTR Value BC847B
SYMBOL npn 3376 18048 R0
SYMATTR InstName Q49
SYMATTR Value BC847B
SYMBOL Res 3520 18368 R0
SYMATTR InstName R23
SYMATTR Value 100
SYMBOL npn 4688 18048 M0
SYMATTR InstName Q50
SYMATTR Value BC847B
SYMBOL npn 4464 18256 R0
SYMATTR InstName Q51
SYMATTR Value BC847B
SYMBOL npn 4368 18048 R0
SYMATTR InstName Q56
SYMATTR Value BC847B
SYMBOL Res 4512 18368 R0
SYMATTR InstName R24
SYMATTR Value 100
SYMBOL pnp 4496 17696 R180
WINDOW 0 60 32 Left 2
WINDOW 3 58 66 Left 2
SYMATTR InstName Q57
SYMATTR Value BC857B
SYMBOL pnp 4560 17696 M180
WINDOW 0 64 34 Left 2
WINDOW 3 61 68 Left 2
SYMATTR InstName Q58
SYMATTR Value BC857B
SYMBOL pnp 4496 17856 R180
WINDOW 0 60 32 Left 2
WINDOW 3 58 66 Left 2
SYMATTR InstName Q59
SYMATTR Value BC857B
SYMBOL pnp 4560 17856 M180
WINDOW 0 64 34 Left 2
WINDOW 3 61 68 Left 2
SYMATTR InstName Q60
SYMATTR Value BC857B
SYMBOL Res 4800 18112 R0
SYMATTR InstName R27
SYMATTR Value 20
SYMBOL Res 4800 17968 R0
SYMATTR InstName R28
SYMATTR Value 360
SYMBOL npn 4944 18288 R0
SYMATTR InstName Q61
SYMATTR Value BC847B
SYMBOL Res 4992 18400 R0
SYMATTR InstName R29
SYMATTR Value 100
SYMBOL npn 4944 17888 R0
SYMATTR InstName Q62
SYMATTR Value BC847B
SYMBOL Res 4160 18272 R0
SYMATTR InstName R22
SYMATTR Value 200
SYMBOL Res 4160 18128 R0
SYMATTR InstName R25
SYMATTR Value 10
SYMBOL Cap 2592 18112 R0
SYMATTR InstName C5
SYMATTR Value 20p
SYMBOL Res 2480 17968 R0
SYMATTR InstName R30
SYMATTR Value 470k
SYMBOL npn 304 16672 R0
SYMATTR InstName Q63
SYMATTR Value BC847B
SYMBOL Res 352 16784 R0
SYMATTR InstName R31
SYMATTR Value 100
SYMBOL npn 304 16368 R0
SYMATTR InstName Q64
SYMATTR Value BC847B
SYMBOL npn 80 17696 M0
SYMATTR InstName Q38
SYMATTR Value BC847B
SYMBOL npn -144 17904 R0
SYMATTR InstName Q39
SYMATTR Value BC847B
SYMBOL npn -240 17696 R0
SYMATTR InstName Q40
SYMATTR Value BC847B
SYMBOL Res -96 18016 R0
SYMATTR InstName R19
SYMATTR Value 100
SYMBOL Cap 176 17680 R0
SYMATTR InstName C6
SYMATTR Value 470p
SYMBOL Res 592 17744 R0
SYMATTR InstName R20
SYMATTR Value 470
SYMBOL Res 592 17888 R0
SYMATTR InstName R32
SYMATTR Value 1
SYMBOL pnp -112 17360 R180
WINDOW 0 60 32 Left 2
WINDOW 3 58 66 Left 2
SYMATTR InstName Q41
SYMATTR Value BC857B
SYMBOL pnp -48 17360 M180
WINDOW 0 64 34 Left 2
WINDOW 3 61 68 Left 2
SYMATTR InstName Q65
SYMATTR Value BC857B
SYMBOL pnp -112 17520 R180
WINDOW 0 60 32 Left 2
WINDOW 3 58 66 Left 2
SYMATTR InstName Q66
SYMATTR Value BC857B
SYMBOL pnp -48 17520 M180
WINDOW 0 64 34 Left 2
WINDOW 3 61 68 Left 2
SYMATTR InstName Q67
SYMATTR Value BC857B
SYMBOL npn 368 17904 R0
SYMATTR InstName Q68
SYMATTR Value BC847B
SYMBOL Res 416 18016 R0
SYMATTR InstName R33
SYMATTR Value 100
SYMBOL npn 368 17600 R0
SYMATTR InstName Q69
SYMATTR Value BC847B
TEXT -440 13760 Left 2 !.tran 0 12m 0n
TEXT 408 13712 Left 4 ;Wide frequency range VCO for Theremin AFE
TEXT 2832 14048 Left 2 !.ic V(RC1)=2.251\n.ic V(RC2)=2.252\n.ic V(INT1)=2.82
TEXT 2800 13984 Left 4 ;Amplitude limiter
TEXT 2504 14256 Left 3 ;Unity gain output buffer - operational amplifier with current feedback
TEXT -560 15800 Left 2 !.ic V(PP1)=2.85\n.ic V(PP2)=2.75
TEXT -2024 17312 Left 4 ;Inverting amplifier\namplitude limiter
TEXT -1928 16128 Left 4 ;Inverting amplifier\namplitude limiter
TEXT 2176 17768 Left 2 !.ic V(LC1)=2.26\n.ic V(LC2)=2.2501\n.ic I(L2)=0.001m

The netlist it stands for:
* vco_sine_bjt_v08.asc
V1 COM 0 4.5
V2 VREF 0 2.25
V19 VCC33 0 3.3
V4 VREF12 0 1.2
Q52 N001 VCOBIAS1 N002 0 BC847B
R60 COM VCOBIAS2 22k
R1 COM VCOBIAS3 4.7k
I1 COM N001 PWL(0 50u 400u 50u 8m 500u)
Q54 VCOBIAS2 VCOBIAS2 N004 0 BC847B
Q55 VCOBIAS3 VCOBIAS3 N005 0 BC847B
Q53 COM N001 VCOBIAS1 0 BC847B
R15 N002 0 100
R16 N005 0 100
R17 N004 0 100
C1 NC_01 0 1n
R40 COM VCOBIAS22 22k
Q125 VCOBIAS22 VCOBIAS22 N003 0 BC847B
R41 N003 0 100
L1 DRIVE ANT 2mH Rser=120 Cpar=1pF
C_ant1 ANT 0 10pF
R66 VCOOUT DRIVE 4.7
Q128 PP1 LPOUT1A N019 0 BC847B
Q129 N019 VCOBIAS1 N024 0 BC847B
Q130 N013 LIM1 N019 0 BC847B
R70 N024 0 100
C8 PP1 0 470p
Q137 LIM2 VREF N047 0 BC847B
Q138 N047 VCOBIAS2 N052 0 BC847B
Q139 N037 LPOUT1 N047 0 BC847B
R74 LIM2 N041 300
R75 N052 0 100
Q140 N035 N033 COM 0 BC857B
Q141 N033 N033 COM 0 BC857B
Q144 LIM2 N041 N046 0 BC847B
Q145 N046 VCOBIAS1 N051 0 BC847B
Q146 N037 VREF N046 0 BC847B
R77 N051 0 100
R78 N041 VREF 20
Q1 N020 N021 N026 0 BC847B
Q2 N026 VCOBIAS1 N032 0 BC847B
Q3 N014 LPOUT1A N026 0 BC847B
R2 N032 0 100
Q4 N014 N009 COM 0 BC857B
Q5 N009 N009 COM 0 BC857B
Q7 AMP1 N014 N009 0 BC857B
Q8 N020 N015 COM 0 BC857B
Q9 N015 N015 COM 0 BC857B
Q11 N027 N020 N015 0 BC857B
Q12 AMP1 N027 N028 0 BC847B
Q14 N028 N028 0 0 BC847B
Q15 N027 N028 0 0 BC847B
C2 AMP1 0 47p
R4 VCOOUT N021 2k
R5 N021 VREF 150
Q19 N026 VCOBIAS1 N031 0 BC847B
R6 N031 0 100
Q22 LIM1 LPOUT2 N018 0 BC847B
Q23 N018 VCOBIAS2 N023 0 BC847B
Q24 N012 VREF N018 0 BC847B
R9 LIM1 N016 300
R10 N023 0 100
Q25 N010 N007 COM 0 BC857B
Q26 N007 N007 COM 0 BC857B
Q29 LIM1 N016 N017 0 BC847B
Q30 N017 VCOBIAS1 N022 0 BC847B
Q31 N012 VREF N017 0 BC847B
R12 N022 0 100
R13 N016 VREF 20
XU2 VREF N006 COM 0 N006 MCP6021  ; pins In+ In- V+ V- OUT
XU3 AMP1 VCOOUT COM 0 VCOOUT MCP6021  ; pins In+ In- V+ V- OUT
R3 LPOUT1 LPOUT1A 470
R8 LPOUT1A VREF 1
Q16 N026 VCOBIAS1 N030 0 BC847B
R7 N030 0 100
Q17 N026 VCOBIAS1 N029 0 BC847B
R11 N029 0 100
Q18 N012 N012 N010 0 BC857B
Q27 LIM1 N012 N007 0 BC857B
Q6 N037 N037 N035 0 BC857B
Q28 LIM2 N037 N033 0 BC857B
Q34 N011 N008 COM 0 BC857B
Q35 N008 N008 COM 0 BC857B
Q37 N013 N013 N011 0 BC857B
Q43 PP1 N013 N008 0 BC857B
Q10 N049 N055 N059 0 BC847B
Q13 N059 VCOBIAS0 N062 0 BC847B
Q20 N044 LC2 N059 0 BC847B
R14 N062 0 100
Q21 N042 N039 COM 0 BC857B
Q32 N039 N039 COM 0 BC857B
Q33 N044 N044 N042 0 BC857B
Q36 N049 N044 N039 0 BC857B
Q42 N067 VCOBIAS0 N068 0 BC847B
I2 COM N067 400µ
Q44 COM N067 VCOBIAS0 0 BC847B
R18 N068 0 100
C3 NC_02 0 1n
L2 N055 VREF 2m Rser=10 Cpar=1p
C4 LC2 LC1 20p
R26 LC2 N055 200
Q45 N057 VCOBIAS0 N064 0 BC847B
R21 N064 0 100
Q46 COM N049 N057 0 BC847B
Q47 N049 N056 N060 0 BC847B
Q48 N060 VCOBIAS0 N063 0 BC847B
Q49 N044 VREF N060 0 BC847B
R23 N063 0 100
Q50 N050 N058 N061 0 BC847B
Q51 N061 VCOBIAS0 N065 0 BC847B
Q56 N045 N057 N061 0 BC847B
R24 N065 0 100
Q57 N043 N040 COM 0 BC857B
Q58 N040 N040 COM 0 BC857B
Q59 N045 N045 N043 0 BC857B
Q60 N050 N045 N040 0 BC857B
R27 N058 VREF 20
R28 N050 N058 360
Q61 LC1 VCOBIAS0 N066 0 BC847B
R29 N066 0 100
Q62 COM N050 LC1 0 BC847B
R22 N056 VREF 200
R25 N057 N056 10
C5 NC_03 VREF 20p
R30 LC2 VREF 470k
Q63 LPOUT1 VCOBIAS2 N025 0 BC847B
R31 N025 0 100
Q64 COM PP1 LPOUT1 0 BC847B
Q38 PP2 LPOUT2A N048 0 BC847B
Q39 N048 VCOBIAS1 N053 0 BC847B
Q40 N038 LIM2 N048 0 BC847B
R19 N053 0 100
C6 PP2 0 470p
R20 LPOUT2 LPOUT2A 470
R32 LPOUT2A VREF 1
Q41 N036 N034 COM 0 BC857B
Q65 N034 N034 COM 0 BC857B
Q66 N038 N038 N036 0 BC857B
Q67 PP2 N038 N034 0 BC857B
Q68 LPOUT2 VCOBIAS2 N054 0 BC847B
R33 N054 0 100
Q69 COM PP2 LPOUT2 0 BC847B
.model NPN NPN
.model PNP PNP
.lib standard.bjt
.tran 0 12m 0n
* Wide frequency range VCO for Theremin AFE
.ic V(RC1)=2.251
.ic V(RC2)=2.252
.ic V(INT1)=2.82
* Amplitude limiter
* Unity gain output buffer - operational amplifier with current feedback
.ic V(PP1)=2.85
.ic V(PP2)=2.75
* Inverting amplifier
* amplitude limiter
* Inverting amplifier
* amplitude limiter
.ic V(LC1)=2.26
.ic V(LC2)=2.2501
.ic I(L2)=0.001m
.lib MCP6021.cir
.backanno
.end